# EAGLE design Schematics_PCB (EAGLE 9.6.2)
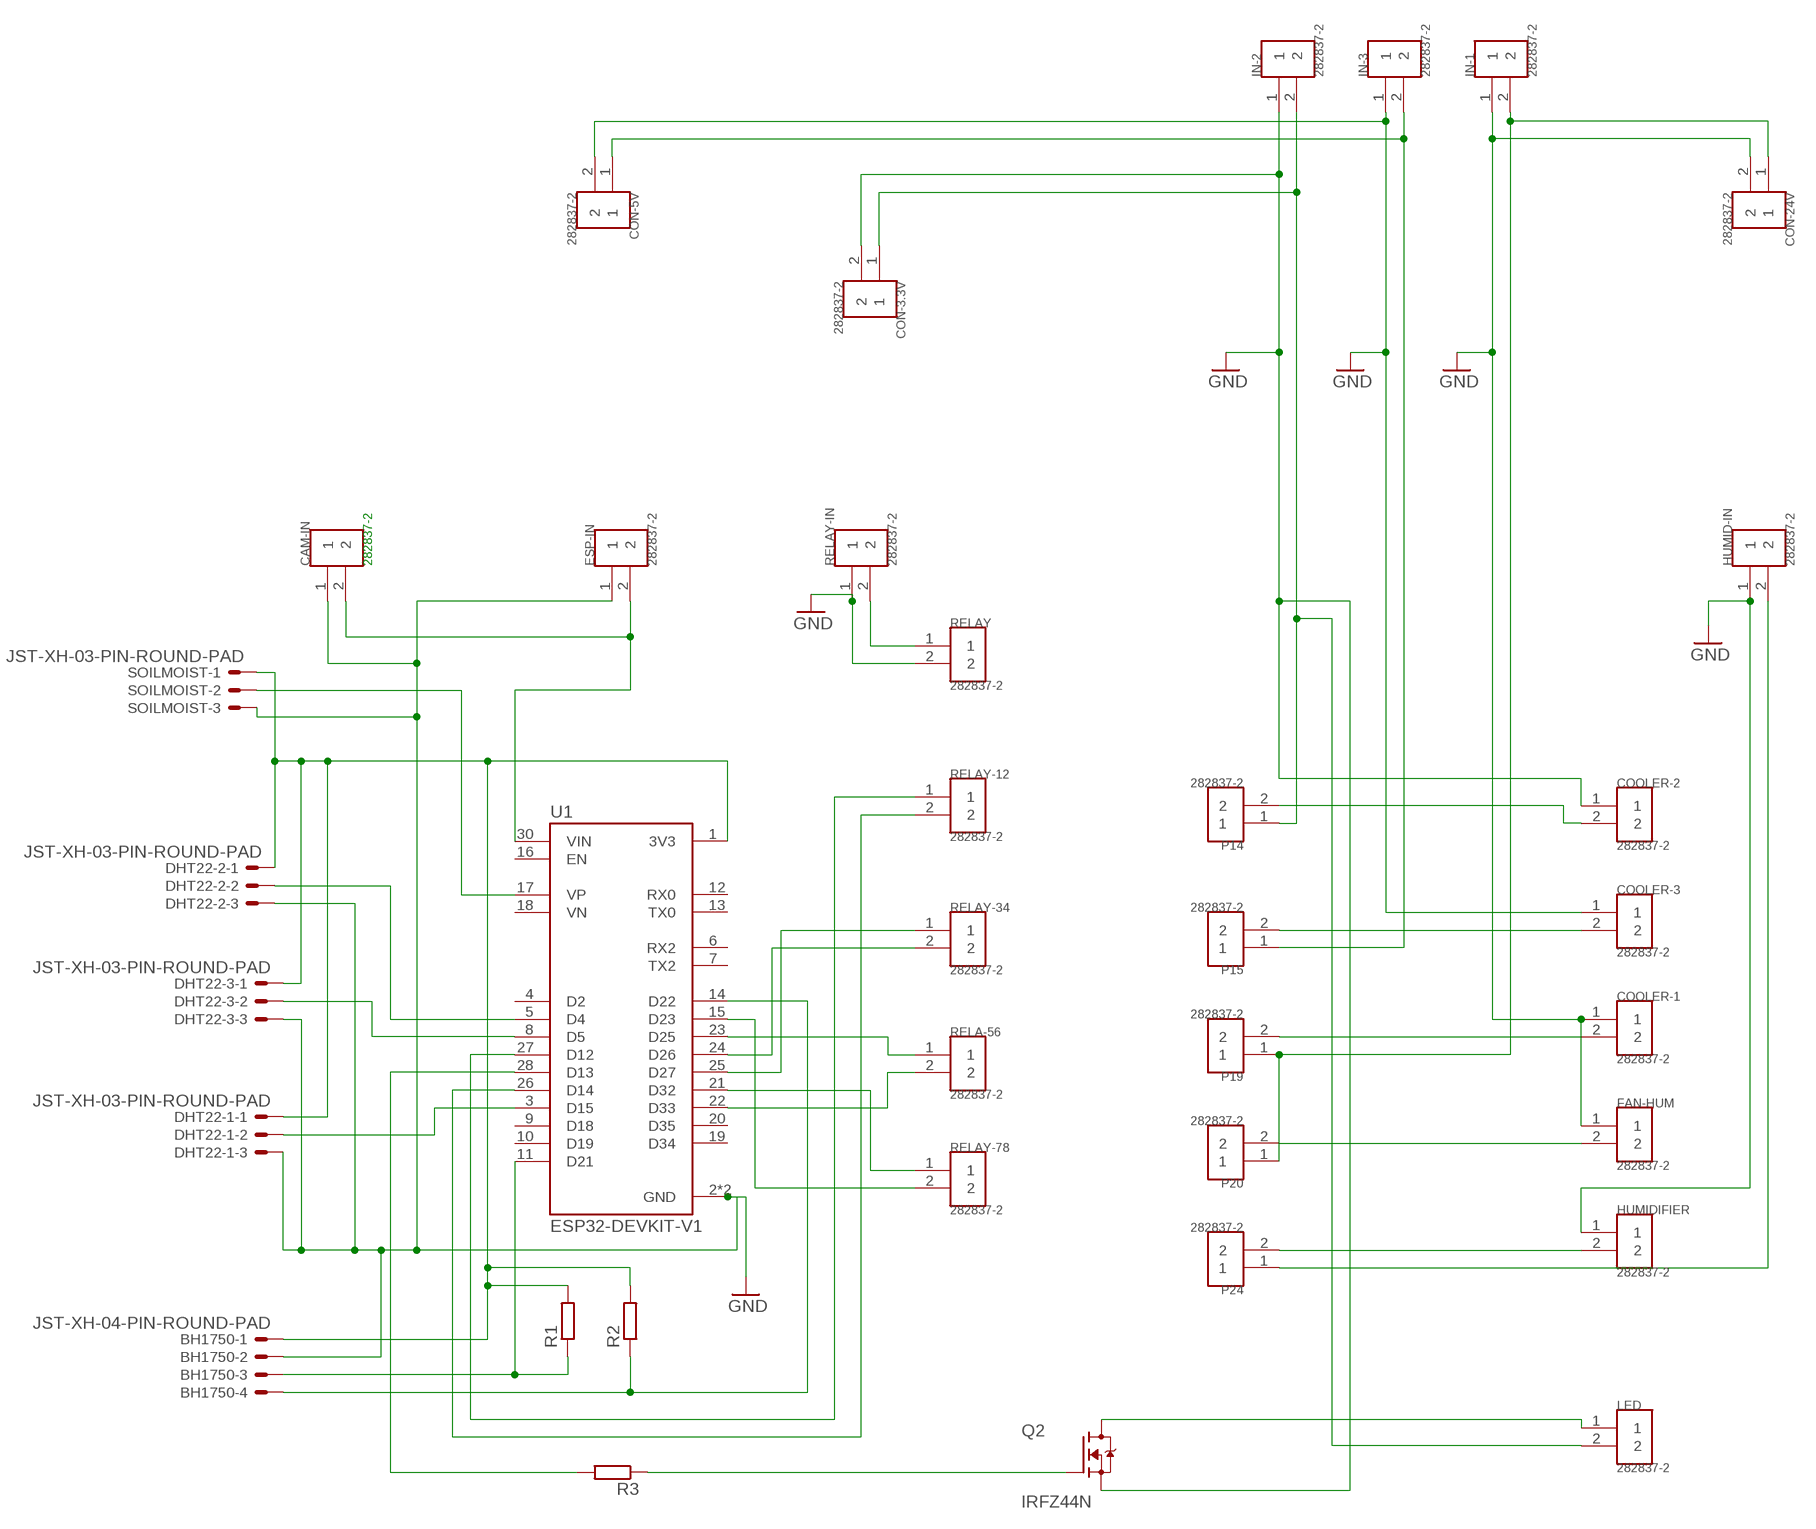
[diagram p0: schematic, sheet 1]

## Parts
BH1750  JST-XH-04-PIN-ROUND-PAD  [JST-XH-04-PACKAGE-ROUND-PAD]
CAM-IN  282837-2  [TE_282837-2]
CON-3.3V  282837-2  [TE_282837-2]
CON-5V  282837-2  [TE_282837-2]
CON-24V  282837-2  [TE_282837-2]
COOLER-1  282837-2  [TE_282837-2]
COOLER-2  282837-2  [TE_282837-2]
COOLER-3  282837-2  [TE_282837-2]
DHT22-1  JST-XH-03-PIN-ROUND-PAD  [JST-XH-03-PACKAGE-ROUND-PAD]
DHT22-2  JST-XH-03-PIN-ROUND-PAD  [JST-XH-03-PACKAGE-ROUND-PAD]
DHT22-3  JST-XH-03-PIN-ROUND-PAD  [JST-XH-03-PACKAGE-ROUND-PAD]
ESP-IN  282837-2  [TE_282837-2]
FAN-HUM  282837-2  [TE_282837-2]
HUMID-IN  282837-2  [TE_282837-2]
HUMIDIFIER  282837-2  [TE_282837-2]
IN-1  282837-2  [TE_282837-2]
IN-2  282837-2  [TE_282837-2]
IN-3  282837-2  [TE_282837-2]
LED  282837-2  [TE_282837-2]
P14  282837-2  [TE_282837-2]
P15  282837-2  [TE_282837-2]
P19  282837-2  [TE_282837-2]
P20  282837-2  [TE_282837-2]
P24  282837-2  [TE_282837-2]
Q2  IRFZ44N  [TO254P1016X419X2286-3]
R1  R-EU_0207/10  [0207/10]
R2  R-EU_0207/10  [0207/10]
R3  R-EU_0207/10  [0207/10]
RELA-56  282837-2  [TE_282837-2]
RELAY  282837-2  [TE_282837-2]
RELAY-12  282837-2  [TE_282837-2]
RELAY-34  282837-2  [TE_282837-2]
RELAY-78  282837-2  [TE_282837-2]
RELAY-IN  282837-2  [TE_282837-2]
SOILMOIST  JST-XH-03-PIN-ROUND-PAD  [JST-XH-03-PACKAGE-ROUND-PAD]
U1  ESP32-DEVKIT-V1  [MODULE_ESP32_DEVKIT_V1]

## Nets
GND: BH1750.2 CAM-IN.1 CON-3.3V.2 CON-5V.2 CON-24V.2 COOLER-1.1 COOLER-2.1 COOLER-3.1 DHT22-1.3 DHT22-2.3 DHT22-3.3 ESP-IN.1 FAN-HUM.1 HUMID-IN.1 HUMIDIFIER.1 IN-1.1 IN-2.1 IN-3.1 Q2.3(S) RELAY-IN.1 RELAY.2 SOILMOIST.3 U1.2(GND) U1.29(GND)
N$1: DHT22-2.2 U1.5(D4)
N$2: DHT22-3.2 U1.8(D5)
N$3: SOILMOIST.2 U1.17(VP)
N$4: DHT22-1.2 U1.3(D15)
N$5: BH1750.1 DHT22-1.1 DHT22-2.1 DHT22-3.1 R1.2 R2.2 SOILMOIST.1 U1.1(3V3)
N$7: RELAY-12.1 U1.27(D12)
N$8: BH1750.3 R1.1 U1.11(D21)
N$9: BH1750.4 R2.1 U1.14(D22)
N$10: RELAY-12.2 U1.26(D14)
N$11: RELAY-34.1 U1.25(D27)
N$12: RELAY-34.2 U1.24(D26)
N$13: RELA-56.1 U1.23(D25)
N$14: RELA-56.2 U1.22(D33)
N$15: RELAY-78.1 U1.21(D32)
N$16: RELAY-78.2 U1.15(D23)
N$17: CAM-IN.2 ESP-IN.2 U1.30(VIN)
N$18: RELAY-IN.2 RELAY.1
N$20: CON-3.3V.1 IN-2.2 LED.2 P14.1
N$21: COOLER-2.2 P14.2
N$23: CON-5V.1 IN-3.2 P15.1
N$24: COOLER-3.2 P15.2
N$26: CON-24V.1 IN-1.2 P19.1 P20.1
N$28: COOLER-1.2 P19.2
N$29: FAN-HUM.2 P20.2
N$30: HUMIDIFIER.2 P24.2
N$31: HUMID-IN.2 P24.1
N$33: R3.2 U1.28(D13)
N$34: Q2.1(G) R3.1
N$35: LED.1 Q2.2(D)
Unconnected: U1.4(D2) U1.6(RX2) U1.7(TX2) U1.9(D18) U1.10(D19) U1.12(RX0) U1.13(TX0) U1.16(EN) U1.18(VN) U1.19(D34) U1.20(D35)

## Library data of the parts
BH1750 = Rembrandt Electronics - JST XH Connectors v1-0:JST-XH-04-PIN: JST XH Connector 2 Pin Wire to board connector. Pitch: 2,54 mm, (0.100") Number of pins: 4 Created by Rembrandt Electronics www.rembrandtelectronics.com
CAM-IN CON-3.3V CON-5V CON-24V COOLER-1-COOLER-3 ESP-IN FAN-HUM HUMID-IN HUMIDIFIER IN-1-IN-3 LED P14 P15 P19 P20 P24 RELA-56 RELAY RELAY-12 RELAY-34 RELAY-78 RELAY-IN = 282837-2:282837-2: TERM BLOCK 5.08MM 2POS SIDE ENTY Check availability <https://pricing.snapeda.com/parts/282837-2/TE%20Connectivity/view-part?ref=eda>; AVAILABILITY: In Stock; COMMENT: 282837-2; DESCRIPTION: Connector Terminal Blocks Receptacle 2 Position 5.08mm Solder Straight Thru-Hole 13.5A/Contact; MF: TE Connectivity; MP: 282837-2; PACKAGE: None; PRICE: None; PURCHASE-URL: https://pricing.snapeda.com/search?q=282837-2&ref=eda
DHT22-1-DHT22-3 SOILMOIST = Rembrandt Electronics - JST XH Connectors v1-0:JST-XH-03-PIN: JST XH Connector 2 Pin Wire to board connector. Pitch: 2,54 mm, (0.100") Number of pins: 3 Created by Rembrandt Electronics www.rembrandtelectronics.com
Q2 = IRFZ44N:IRFZ44N: Check availability <https://pricing.snapeda.com/parts/IRFZ44N/Infineon%20Technologies/view-part?ref=eda>; AVAILABILITY: In Stock; DESCRIPTION: N-Channel 55 V 49A (Tc) 94W (Tc) Through Hole TO-220AB; MF: Infineon Technologies; MP: IRFZ44N; PACKAGE: TO-220-3 Infineon; PRICE: None
R1-R3 = rcl:R-EU_: RESISTOR, European symbol; SPICEPREFIX: R
U1 = ESP32-DEVKIT-V1:ESP32-DEVKIT-V1: Dual core, Wi-Fi: 2.4 GHz up to 150 Mbits/s,BLE (Bluetooth Low Energy) and legacy Bluetooth, 32 bits, Up to 240 MHz Check availability <https://pricing.snapeda.com/parts/ESP32-DEVKIT-V1/Do%20it/view-part?ref=eda>; AVAILABILITY: Not in stock; DESCRIPTION: Dual core, Wi-Fi: 2.4 GHz up to 150 Mbits/s,BLE (Bluetooth Low Energy) and legacy Bluetooth, 32 bits, Up to 240 MHz; MF: Do it; MP: ESP32-DEVKIT-V1; PACKAGE: None; PRICE: None

## Board
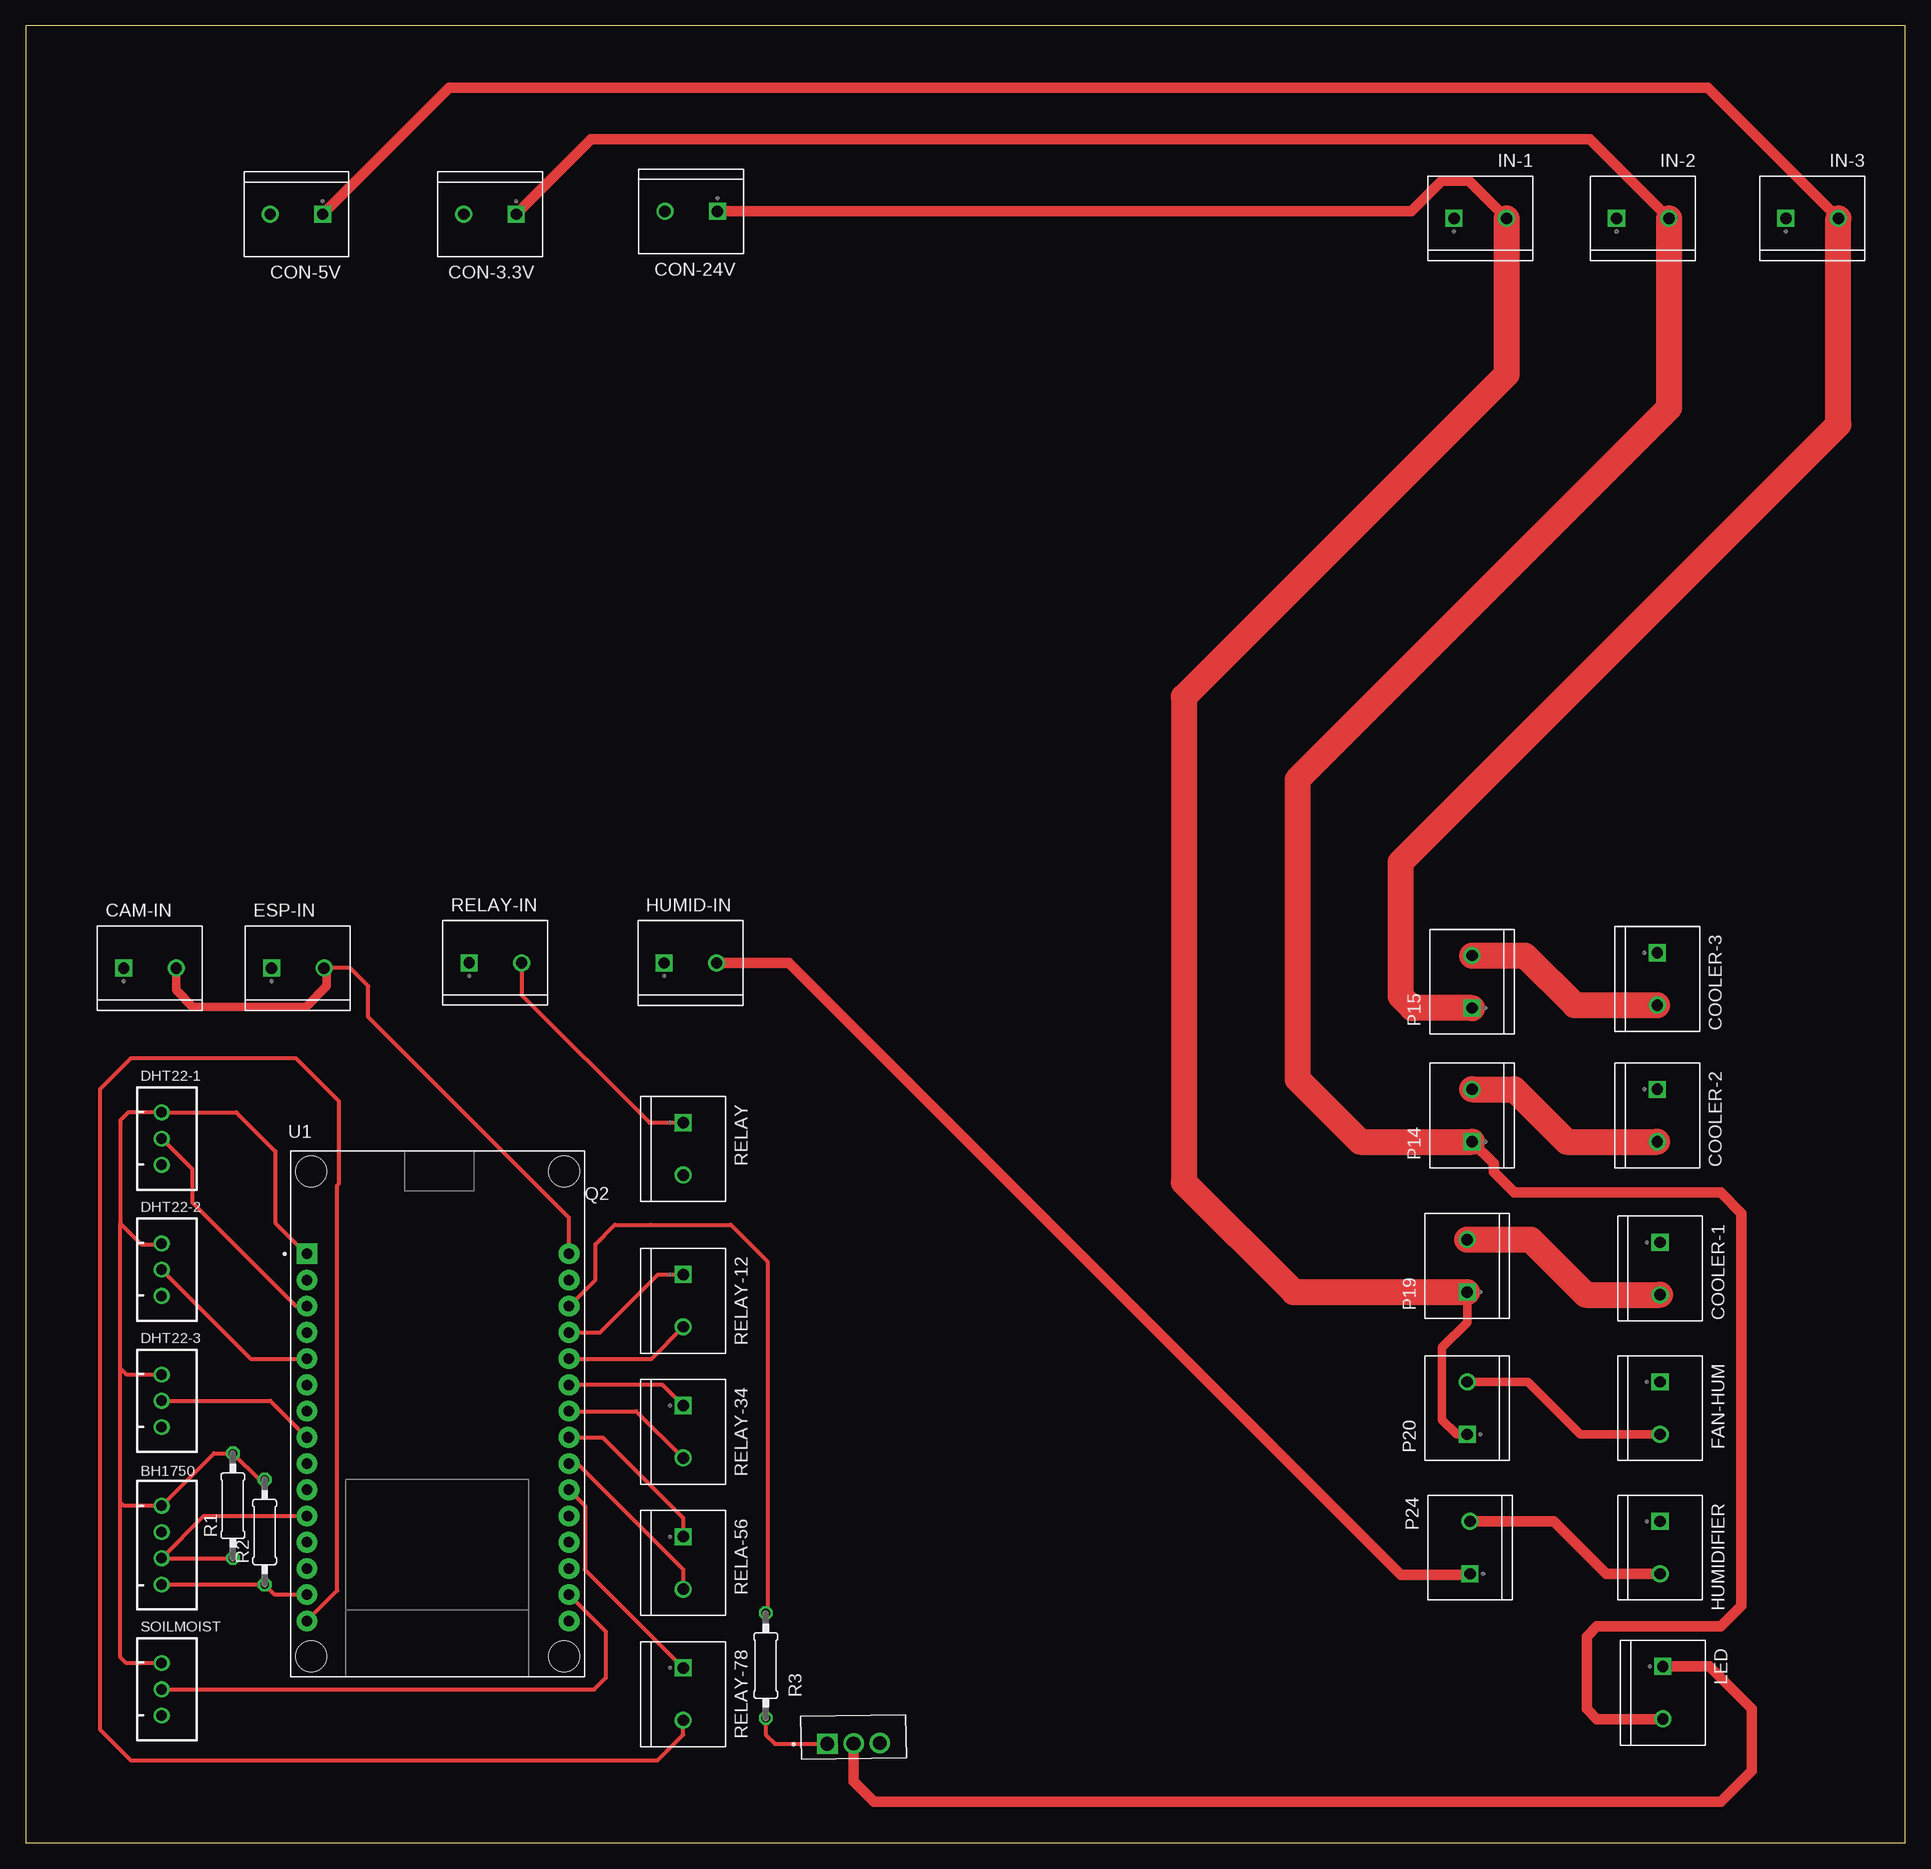
[diagram p1: board, top side]
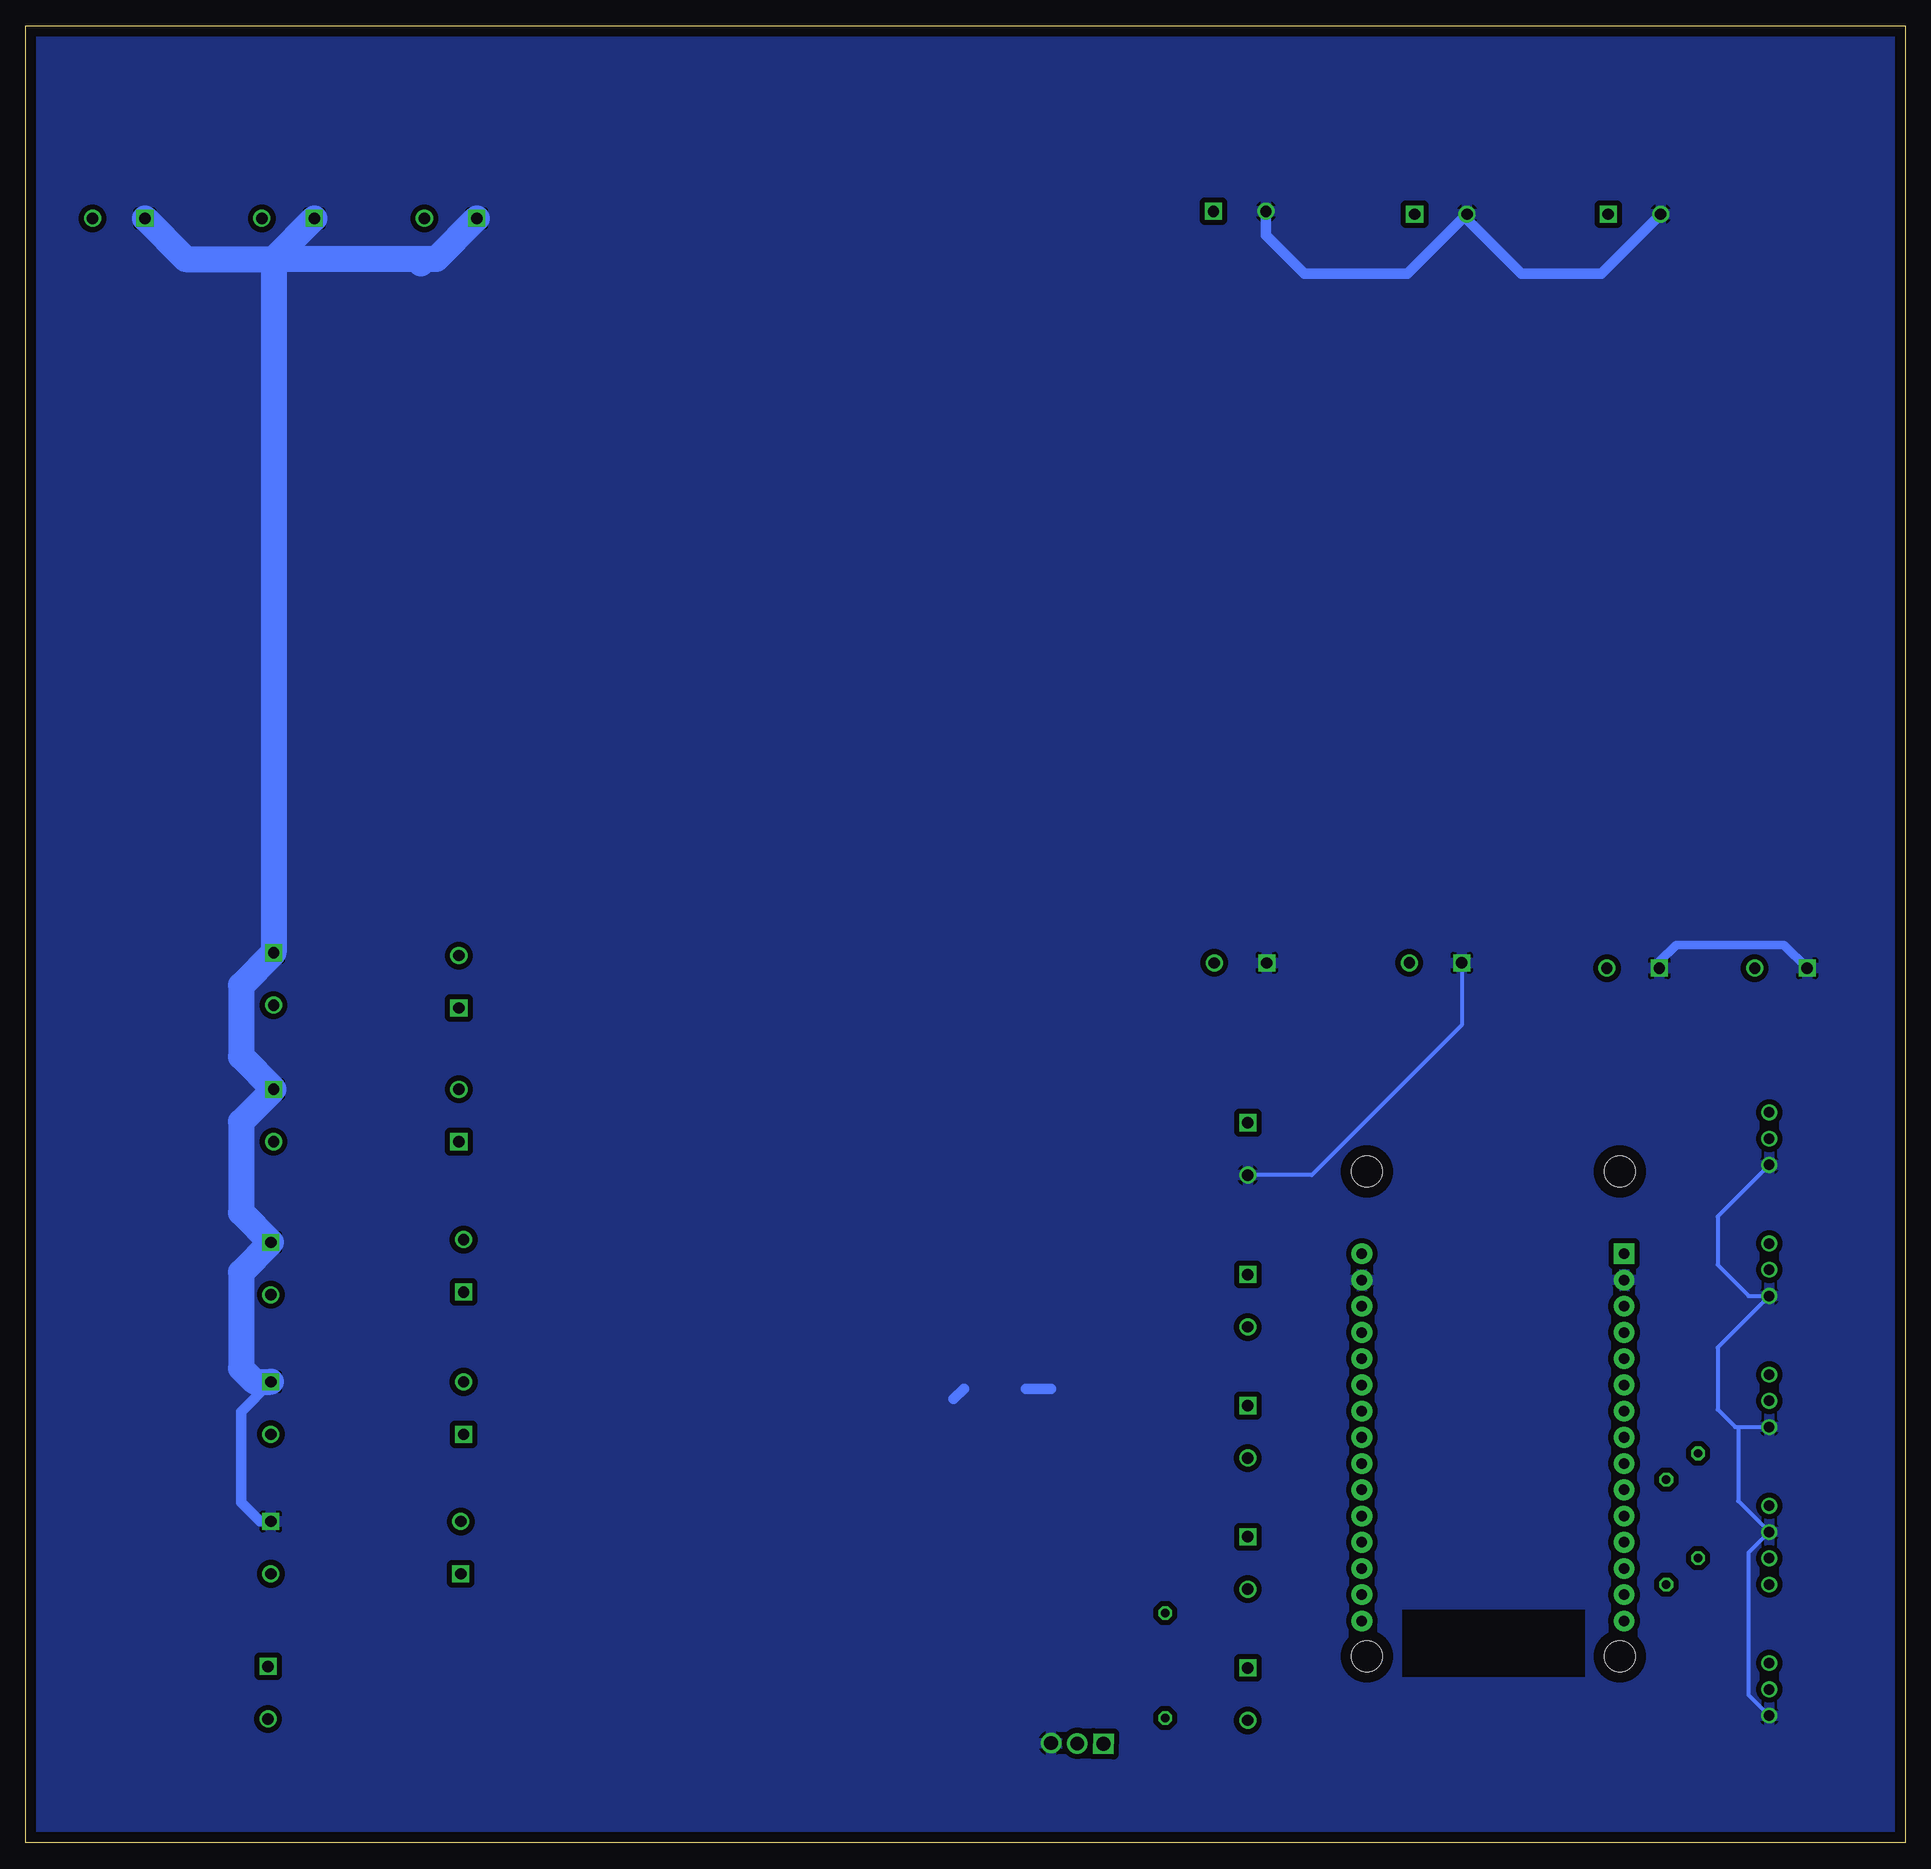
[diagram p2: board, bottom side, seen from below]

Size 182 x 175.97 mm. Coordinates in mm from the lower left corner, seen from the top.
Outline: 0,0 182,0 182,175.97 0,175.97 0,0
Copper layers (1*16): Top 0.035mm / dielectric 1.5mm / Bottom 0.035mm
Design rules "default *": minimum track width 6mil, minimum drill 0.35mm, track to track 20mil, track to pad 6mil, pad to pad 6mil, via to via 6mil, smd to smd 6mil, copper to edge 40mil, drill to drill 6mil, minimum pad ring 10mil, minimum via ring 8mil, stop-mask expansion 4mil, vias tented up to drill 0mil, thermal gap 10mil

### Footprints (pad centres in the part's own frame; a part is rotated, then mirrored left to right if it is on the bottom)
JST-XH-04-PACKAGE-ROUND-PAD = drill 1.016: 1 -3.81,0; 2 -1.27,0; 3 1.27,0; 4 3.81,0
TE_282837-2 = drill 1.1 square: 1 -2.54,0 | drill 1.1: 2 2.54,0
JST-XH-03-PACKAGE-ROUND-PAD = drill 1.016: 1 -2.54,0; 2 0,0; 3 2.54,0
TO254P1016X419X2286-3 = drill 1.33 square: 1 -2.54,0 | drill 1.33: 2 0,0; 3 2.54,0
0207/10 = drill 0.813 octagon: 1 -5.08,0; 2 5.08,0
MODULE_ESP32_DEVKIT_V1 = drill 1.02 pad 2 square: 1 -12.7,15.515 | drill 1.02 pad 2: 2 -12.7,12.975; 3 -12.7,10.435; 4 -12.7,7.895; 5 -12.7,5.355; 6 -12.7,2.815; 7 -12.7,0.275; 8 -12.7,-2.265; 9 -12.7,-4.805; 10 -12.7,-7.345; 11 -12.7,-9.885; 12 -12.7,-12.425; 13 -12.7,-14.965; 14 -12.7,-17.505; 15 -12.7,-20.045; 16 12.7,-20.045; 17 12.7,-17.505; 18 12.7,-14.965; 19 12.7,-12.425; 20 12.7,-9.885; 21 12.7,-7.345; 22 12.7,-4.805; 23 12.7,-2.265; 24 12.7,0.275; 25 12.7,2.815; 26 12.7,5.355; 27 12.7,7.895; 28 12.7,10.435; 29 12.7,12.975; 30 12.7,15.515 | hole 3: -12.28,-23.475; 12.23,-23.475; 12.23,23.475; -12.28,23.475

### Placement (x,y rotation side)
BH1750  13.16,28.83 270 top
CAM-IN  12.02,84.71 0 top
CON-3.3V  44.96,157.73 180 top
CON-5V  26.21,157.73 180 top
CON-24V  64.44,158 180 top
COOLER-1  158.27,55.61 270 top
COOLER-2  158,70.44 270 top
COOLER-3  158,83.66 270 top
DHT22-1  13.16,68.2 270 top
DHT22-2  13.16,55.5 270 top
DHT22-3  13.16,42.8 270 top
ESP-IN  26.34,84.71 0 top
FAN-HUM  158.27,42.1 270 top
HUMID-IN  64.36,85.21 0 top
HUMIDIFIER  158.27,28.59 270 top
IN-1  140.86,157.32 0 top
IN-2  156.6,157.32 0 top
IN-3  173,157.32 0 top
LED  158.54,14.54 270 top
P14  140.06,70.44 90 top
P15  140.06,83.39 90 top
P19  139.6,55.88 90 top
P20  139.6,42.1 90 top
P24  139.87,28.59 90 top
Q2  80.17,9.62 0.8 top
R1  20.05,32.64 90 top
R2  23.13,30.1 90 top
R3  71.66,17.16 90 top
RELA-56  63.66,27.1 270 top
RELAY  63.66,67.2 270 top
RELAY-12  63.66,52.5 270 top
RELAY-34  63.66,39.8 270 top
RELAY-78  63.66,14.4 270 top
RELAY-IN  45.47,85.22 0 top
SOILMOIST  13.16,14.86 270 top
U1  39.91,41.53 0 top

### Tracks (layer width: path | path; a pad name or v marks a point on that pad's centre or on a via)
GND
  Bottom 0.4: DHT22-1.3 18.16,60.66 18.16,55.97 15.15,52.96 DHT22-2.3 18.16,47.96 18.16,41.97 16.45,40.26 16.16,40.26 | 16.16,40.26 DHT22-3.3 | 16.16,40.26 16.16,33.1 BH1750.2 15.16,28.1 15.16,14.32 SOILMOIST.3 | RELAY-IN.1 42.93,79.2 57.47,64.66 RELAY.2
  Bottom 0.813: CAM-IN.1 11.74,86.97 22.16,86.97 23.8,85.33 ESP-IN.1
  Bottom 1.016: FAN-HUM.1 161.16,41.75 161.16,32.97 159.32,31.13 HUMIDIFIER.1 | CON-5V.2 29.43,151.97 37.16,151.97 42.42,157.23 CON-3.3V.2 48.18,151.97 58.16,151.97 61.9,155.71 CON-24V.2 | 82.71,43.97 | 82.71,43.97 85.16,43.97 | 91.16,43.97 92.16,42.97
  Bottom 2.54: IN-2.1 158,153.38 | 158,153.38 COOLER-3.1 161.16,83.04 161.16,76.14 COOLER-2.1 161.16,69.82 161.16,61.04 COOLER-1.1 161.16,55.26 161.16,45.97 159.83,44.64 FAN-HUM.1 | 144.16,153.38 142.26,153.38 IN-1.1 | 144.16,153.38 158,153.38 | IN-3.1 166.52,153.38 158,153.38 | 143.75,152.97 144.16,153.38
  pour Bottom: 0.16,175.97 182.16,175.97 182.16,-0.03 0.16,-0.03
N$1
  Top 0.4: DHT22-2.2 21.77,46.88 U1.5
N$2
  Top 0.4: DHT22-3.2 23.67,42.8 U1.8
N$3
  Top 0.4: U1.17 56.16,20.47 56.16,15.97 55.05,14.86 40.16,14.86 SOILMOIST.2
N$4
  Top 0.406: U1.3 26.16,51.97 16.16,61.97 16.16,65.2 DHT22-1.2
N$5
  Top 0.4: U1.1 27.16,57.05 | R2.2 22.59,35.18 R1.2 18.24,37.72 BH1750.1 9.49,32.64 9.16,32.97 | DHT22-1.1 9.93,70.74 9.16,69.97 9.16,59.97 | 9.16,59.97 11.16,57.97 13.09,57.97 DHT22-2.1 | DHT22-3.1 9.79,45.34 9.16,45.97 | 9.16,45.97 9.16,59.97 | 9.16,32.97 9.16,45.97 | SOILMOIST.1 9.73,17.4 9.16,17.97 9.16,32.97
  Top 0.406: DHT22-1.1 20.39,70.74 24.16,66.97 24.16,60.05 27.16,57.05
N$7
  Top 0.406: U1.27 55.61,49.42 61.23,55.04 RELAY-12.1
N$8
  Top 0.4: U1.11 17.24,31.64 BH1750.3 R1.1
N$9
  Top 0.4: BH1750.4 R2.1 24.12,24.02 U1.14
N$10
  Top 0.406: U1.26 60.58,46.88 RELAY-12.2
N$11
  Top 0.4: RELAY-34.1 61.66,44.34 U1.25
N$12
  Top 0.4: U1.24 59.11,41.8 RELAY-34.2
N$13
  Top 0.406: U1.23 55.86,39.27 63.66,31.47 RELA-56.1
N$14
  Top 0.406: U1.22 53.41,36.73 63.66,26.47 RELA-56.2
N$15
  Top 0.406: U1.21 54.16,32.63 54.16,26.44 57.39,23.2 RELAY-78.1
N$16
  Top 0.4: U1.15 30.16,24.43 30.16,63.69 30.35,63.88 30.35,71.78 26.16,75.97 10.16,75.97 7.16,72.97 7.16,10.97 10.16,7.97 32.16,7.97 61.16,7.97 63.66,10.47 RELAY-78.2
N$17
  Top 0.4: ESP-IN.2 29.16,84.71 31.42,84.71 33.16,82.97 33.16,79.97 52.61,60.52 U1.30
  Top 0.813: CAM-IN.2 14.56,82.57 16.16,80.97 27.16,80.97 29.16,82.97 29.16,84.71
N$18
  Top 0.4: RELAY-IN.2 48.01,82.12 60.39,69.74 RELAY.1
N$20
  Top 1.016: CON-3.3V.1 54.74,164.97 151.49,164.97 IN-2.2 | LED.2 158.51,11.97 152.16,11.97 151.16,12.97 151.16,19.97 152.16,20.97 164.16,20.97 166.16,22.97 166.16,60.97 164.16,62.97 144.16,62.97 142.16,64.97 142.16,65.8 P14.1
  Top 2.54: IN-2.2 159.14,138.95 123.16,102.97 123.16,73.97 129.23,67.9 P14.1
N$21
  Top 2.54: P14.2 144.15,72.98 149.23,67.9 COOLER-2.2
N$23
  Top 1.016: CON-5V.1 40.99,169.97 162.89,169.97 IN-3.2
  Top 2.54: P15.1 134.28,80.85 133.16,81.97 133.16,94.97 175.54,137.35 IN-3.2
N$24
  Top 2.54: P15.2 145.2,85.93 150.01,81.12 COOLER-3.2
N$26
  Top 0.813: P20.1 138.57,39.56 137.16,40.97 137.16,47.97 139.6,50.41 P19.1
  Top 1.016: CON-24V.1 134.19,158 137.16,160.97 139.75,160.97 IN-1.2
  Top 2.54: IN-1.2 143.4,142.21 112.16,110.97 112.16,63.97 122.79,53.34 P19.1
N$28
  Top 2.54: P19.2 145.71,58.42 151.06,53.07 COOLER-1.2
N$29
  Top 0.813: P20.2 145.49,44.64 150.57,39.56 FAN-HUM.2
N$30
  Top 1.016: P24.2 148,31.13 153.08,26.05 HUMIDIFIER.2
N$31
  Top 1.016: HUMID-IN.2 73.92,85.21 133.16,25.97 139.79,25.97 P24.1
N$33
  Top 0.4: 60.49,59.85 68.28,59.85 71.82,56.31 71.82,22.24 R3.2
  Top 0.406: U1.28 55.16,54.52 55.16,57.97 57.04,59.85 60.49,59.85
N$34
  Top 0.4: R3.1 71.66,10.47 72.55,9.58 Q2.1
N$35
  Top 1.016: Q2.2 80.17,5.98 80.16,5.97 82.16,3.97 164.16,3.97 167.16,6.97 167.16,12.97 163.05,17.08 LED.1